# Altium schematic sheet REF5040.SchDoc
size A4
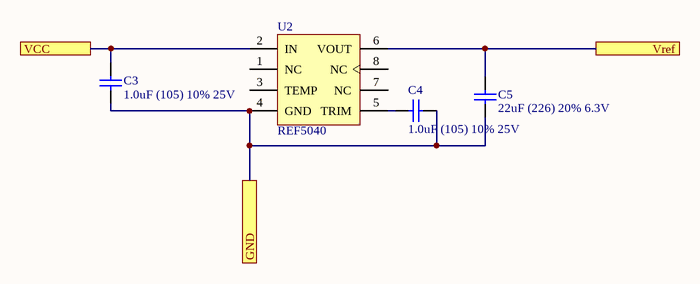
[diagram p0: REF5040.SchDoc]

## Parts
C3  1.0uF (105) 10% 25V  [0402_C]
C4  1.0uF (105) 10% 25V  [0402_C]
C5  22uF (226) 20% 6.3V  [0603_C]
U2  REF5040  [SOP8_N]

## Ports
GND, VCC, Vref

## Nets
GND: C3.1 C4.2 C5.1 U2.4(GND) ; port GND
VCC: C3.2 U2.2(IN) ; port VCC
Vref: C5.2 U2.6(VOUT) ; port Vref
NetC4_1: C4.1 U2.5(TRIM)

Not connected (* = marked no-connect by the designer): U2 1(NC) 3(TEMP) 7(NC) 8(NC)

## Library data of the parts
C3 C4 = 0402 1.0uF (105) 10% 25V: 贴片电容; ComponentLink1Description: 供应商链接; ComponentLink1URL: http://www.szlcsc.com/product/details_53938.html; Package: 0402; Supplier: LC; SuppliersPartNumber: C52923
C5 = 0603 22uF (226) 20% 6.3V: 贴片电容; ComponentLink1Description: 供应商链接; ComponentLink1URL: http://www.szlcsc.com/product/details_60514.html; Package: 0603; Supplier: LC; SuppliersPartNumber: C59461
U2 = REF5040: 高精度电压基准; 版权归属: 源创客; BOM名称: 高精度电压基准; 学习资源: www.ooocke.com